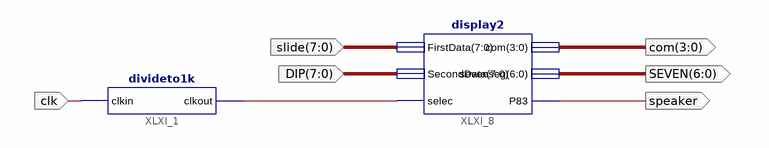
[diagram p0: schematic sheet 1]
// Xilinx ISE schematic main.sch (spartan6) as structural Verilog: 2 symbols, 6 ports
module main (
  input  clk,
  input  [7:0] slide,
  input  [7:0] DIP,
  output [6:0] SEVEN,
  output speaker,
  output [3:0] com
);

  wire screen;

  divideto1k XLXI_1 (.clkin(clk), .clkout(screen));
  display2 XLXI_8 (.FirstData(slide), .SecondData(DIP), .selec(screen), .com(com), .sevenseg(SEVEN), .P83(speaker));

  // Notes on the sheet:
  //   LOC on signal speaker = P83
endmodule
